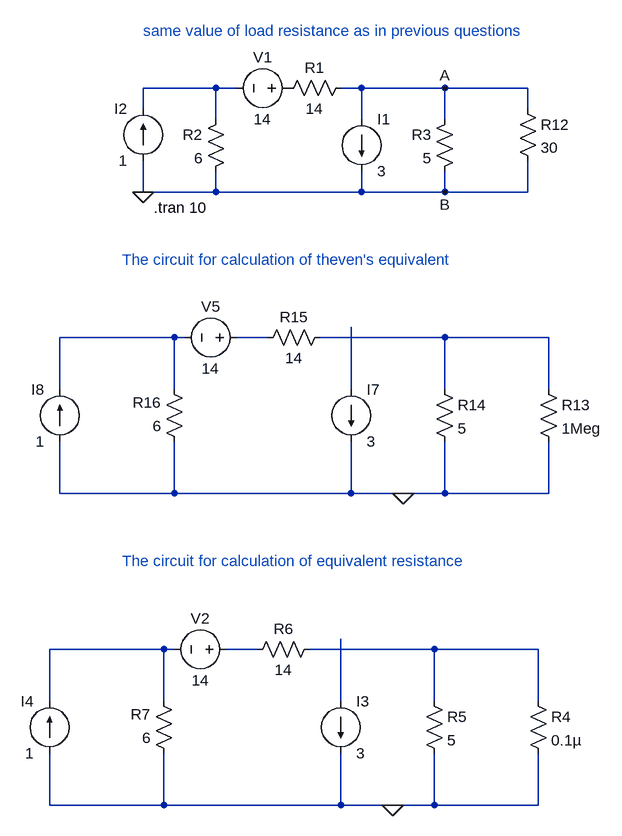
[diagram p0: schematic Lab2_ques5.asc]
Lab2_ques5.asc, the LTspice schematic file:
Version 4
SHEET 1 1828 1344
WIRE 144 160 32 160
WIRE 176 160 144 160
WIRE 368 160 336 160
WIRE 496 160 368 160
WIRE 624 160 496 160
WIRE 32 192 32 160
WIRE 624 192 624 160
WIRE 144 208 144 160
WIRE 368 208 368 160
WIRE 496 208 496 160
WIRE 32 320 32 272
WIRE 144 320 144 288
WIRE 144 320 32 320
WIRE 368 320 368 288
WIRE 368 320 144 320
WIRE 496 320 496 288
WIRE 496 320 368 320
WIRE 624 320 624 272
WIRE 624 320 496 320
WIRE 80 544 -96 544
WIRE 96 544 80 544
WIRE 224 544 176 544
WIRE 496 544 304 544
WIRE 656 544 496 544
WIRE -96 624 -96 544
WIRE 80 624 80 544
WIRE 352 624 352 528
WIRE 496 624 496 544
WIRE 656 624 656 544
WIRE -96 784 -96 704
WIRE 80 784 80 704
WIRE 80 784 -96 784
WIRE 352 784 352 704
WIRE 352 784 80 784
WIRE 432 784 352 784
WIRE 496 784 496 704
WIRE 496 784 432 784
WIRE 656 784 656 704
WIRE 656 784 496 784
WIRE 64 1024 -112 1024
WIRE 80 1024 64 1024
WIRE 208 1024 160 1024
WIRE 480 1024 288 1024
WIRE 640 1024 480 1024
WIRE -112 1104 -112 1024
WIRE 64 1104 64 1024
WIRE 336 1104 336 1008
WIRE 480 1104 480 1024
WIRE 640 1104 640 1024
WIRE -112 1264 -112 1184
WIRE 64 1264 64 1184
WIRE 64 1264 -112 1264
WIRE 336 1264 336 1184
WIRE 336 1264 64 1264
WIRE 416 1264 336 1264
WIRE 480 1264 480 1184
WIRE 480 1264 416 1264
WIRE 640 1264 640 1184
WIRE 640 1264 480 1264
FLAG 496 160 A
FLAG 496 320 B
FLAG 32 320 0
FLAG 432 784 0
FLAG 416 1264 0
SYMBOL Res 352 144 R90
WINDOW 0 0 56 VBottom 2
WINDOW 3 32 56 VTop 2
SYMATTR InstName R1
SYMATTR Value 14
SYMBOL Res 160 192 M0
SYMATTR InstName R2
SYMATTR Value 6
SYMBOL Res 512 192 M0
SYMATTR InstName R3
SYMATTR Value 5
SYMBOL voltage 272 160 R90
WINDOW 0 -32 56 VBottom 2
WINDOW 3 32 56 VTop 2
SYMATTR InstName V1
SYMATTR Value 14
SYMBOL current 368 208 R0
SYMATTR InstName I1
SYMATTR Value 3
SYMBOL current 32 272 R180
WINDOW 0 24 80 Left 2
WINDOW 3 24 0 Left 2
SYMATTR InstName I2
SYMATTR Value 1
SYMBOL Res 608 176 R0
SYMATTR InstName R12
SYMATTR Value 30
SYMBOL Res 640 608 R0
SYMATTR InstName R13
SYMATTR Value 1Meg
SYMBOL Res 480 608 R0
SYMATTR InstName R14
SYMATTR Value 5
SYMBOL Res 320 528 R90
WINDOW 0 0 56 VBottom 2
WINDOW 3 32 56 VTop 2
SYMATTR InstName R15
SYMATTR Value 14
SYMBOL Res 96 720 R180
WINDOW 0 36 76 Left 2
WINDOW 3 36 40 Left 2
SYMATTR InstName R16
SYMATTR Value 6
SYMBOL voltage 192 544 R90
WINDOW 0 -32 56 VBottom 2
WINDOW 3 32 56 VTop 2
SYMATTR InstName V5
SYMATTR Value 14
SYMBOL current 352 624 R0
SYMATTR InstName I7
SYMATTR Value 3
SYMBOL current -96 704 R180
WINDOW 0 24 80 Left 2
WINDOW 3 24 0 Left 2
SYMATTR InstName I8
SYMATTR Value 1
SYMBOL Res 624 1088 R0
SYMATTR InstName R4
SYMATTR Value 0.1µ
SYMBOL Res 464 1088 R0
SYMATTR InstName R5
SYMATTR Value 5
SYMBOL Res 304 1008 R90
WINDOW 0 0 56 VBottom 2
WINDOW 3 32 56 VTop 2
SYMATTR InstName R6
SYMATTR Value 14
SYMBOL Res 80 1200 R180
WINDOW 0 36 76 Left 2
WINDOW 3 36 40 Left 2
SYMATTR InstName R7
SYMATTR Value 6
SYMBOL voltage 176 1024 R90
WINDOW 0 -32 56 VBottom 2
WINDOW 3 32 56 VTop 2
SYMATTR InstName V2
SYMATTR Value 14
SYMBOL current 336 1104 R0
SYMATTR InstName I3
SYMATTR Value 3
SYMBOL current -112 1184 R180
WINDOW 0 24 80 Left 2
WINDOW 3 24 0 Left 2
SYMATTR InstName I4
SYMATTR Value 1
TEXT 32 72 Left 2 ;same value of load resistance as in previous questions
TEXT 0 424 Left 2 ;The circuit for calculation of theven's equivalent
TEXT 0 888 Left 2 ;The circuit for calculation of equivalent resistance
TEXT 48 344 Left 2 !.tran 10

The netlist it stands for:
* Lab2_ques5.asc
R1 A P001 14
R2 N001 0 6
R3 A 0 5
V1 P001 N001 14
I1 A 0 3
I2 0 N001 1
R12 A 0 30
R13 N004 0 1Meg
R14 N004 0 5
R15 N004 N003 14
R16 0 N002 6
V5 N003 N002 14
I7 N005 0 3
I8 0 N002 1
R4 N008 0 0.1µ
R5 N008 0 5
R6 N008 N007 14
R7 0 N006 6
V2 N007 N006 14
I3 N009 0 3
I4 0 N006 1
* same value of load resistance as in previous questions
* The circuit for calculation of theven's equivalent
* The circuit for calculation of equivalent resistance
.tran 10
.backanno
.end